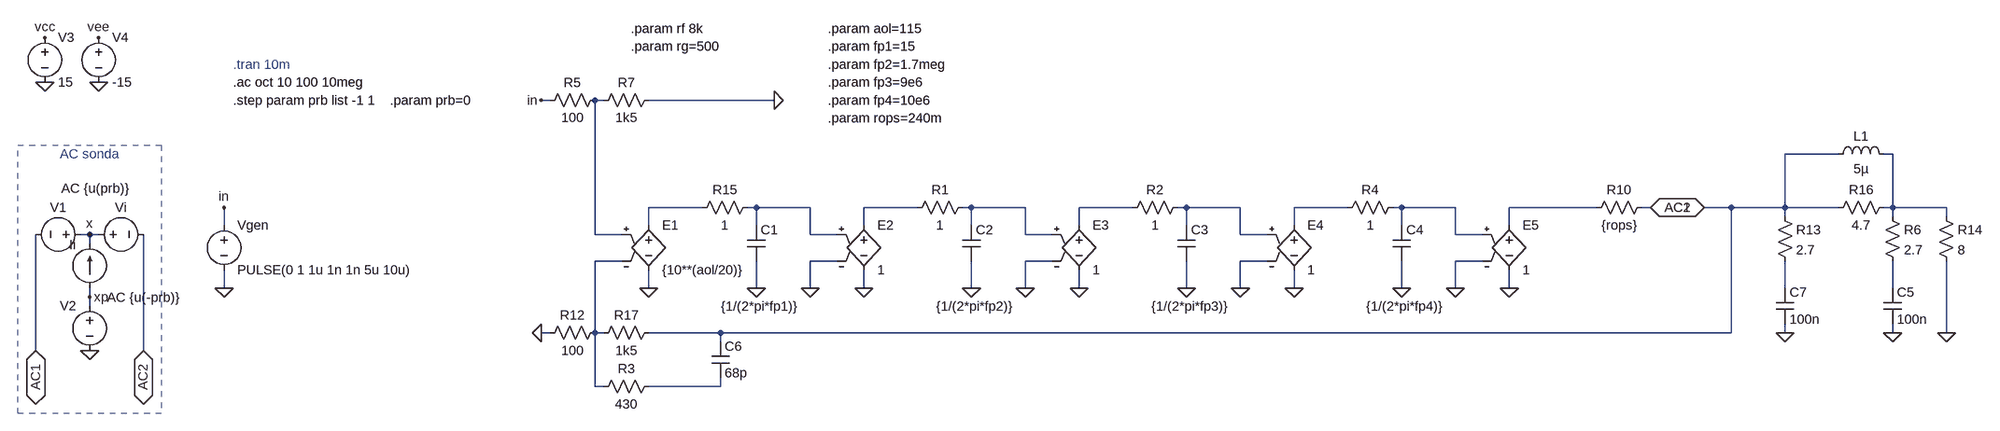
[diagram p0: schematic lm_ac.asc]
lm_ac.asc, the LTspice schematic file:
Version 4
SHEET 1 2596 680
WIRE -16 -96 -32 -96
WIRE 80 -96 64 -96
WIRE 384 -96 160 -96
WIRE 2336 0 2240 0
WIRE 2432 0 2416 0
WIRE 256 96 160 96
WIRE 352 96 336 96
WIRE 448 96 352 96
WIRE 640 96 544 96
WIRE 736 96 720 96
WIRE 832 96 736 96
WIRE 1024 96 928 96
WIRE 1120 96 1104 96
WIRE 1216 96 1120 96
WIRE 1408 96 1312 96
WIRE 1504 96 1488 96
WIRE 1600 96 1504 96
WIRE 1904 96 1696 96
WIRE 2000 96 1984 96
WIRE 2144 96 2096 96
WIRE 2240 96 2240 0
WIRE 2240 96 2144 96
WIRE 2336 96 2240 96
WIRE 2432 96 2432 0
WIRE 2432 96 2416 96
WIRE 2528 96 2432 96
WIRE 2240 112 2240 96
WIRE 2432 112 2432 96
WIRE 2528 112 2528 96
WIRE -608 128 -608 96
WIRE 160 128 160 96
WIRE 352 128 352 96
WIRE 544 128 544 96
WIRE 736 128 736 96
WIRE 928 128 928 96
WIRE 1120 128 1120 96
WIRE 1312 128 1312 96
WIRE 1504 128 1504 96
WIRE 1696 128 1696 96
WIRE -848 144 -864 144
WIRE -832 144 -848 144
WIRE 64 144 64 -96
WIRE 112 144 64 144
WIRE 448 144 448 96
WIRE 496 144 448 144
WIRE 832 144 832 96
WIRE 880 144 832 144
WIRE 1216 144 1216 96
WIRE 1264 144 1216 144
WIRE 1600 144 1600 96
WIRE 1648 144 1600 144
WIRE -848 160 -848 144
WIRE 112 192 64 192
WIRE 496 192 448 192
WIRE 880 192 832 192
WIRE 1264 192 1216 192
WIRE 1648 192 1600 192
WIRE -608 240 -608 208
WIRE 160 240 160 208
WIRE 352 240 352 192
WIRE 448 240 448 192
WIRE 544 240 544 208
WIRE 736 240 736 192
WIRE 832 240 832 192
WIRE 928 240 928 208
WIRE 1120 240 1120 192
WIRE 1216 240 1216 192
WIRE 1312 240 1312 208
WIRE 1504 240 1504 192
WIRE 1600 240 1600 192
WIRE 1696 240 1696 208
WIRE 2240 240 2240 192
WIRE 2432 240 2432 192
WIRE -848 256 -848 240
WIRE -848 272 -848 256
WIRE -16 320 -32 320
WIRE 64 320 64 192
WIRE 80 320 64 320
WIRE 288 320 160 320
WIRE 2144 320 2144 96
WIRE 2144 320 288 320
WIRE 2240 320 2240 304
WIRE 2432 320 2432 304
WIRE 2528 320 2528 192
WIRE 288 336 288 320
WIRE -944 352 -944 144
WIRE -752 352 -752 144
WIRE 64 416 64 320
WIRE 80 416 64 416
WIRE 288 416 288 400
WIRE 288 416 160 416
FLAG -608 240 0
FLAG 160 240 0
FLAG -608 96 in
FLAG -848 144 x
FLAG -848 256 xp
FLAG -944 352 AC1
IOPIN -944 352 BiDir
FLAG -752 352 AC2
IOPIN -752 352 BiDir
FLAG 2000 96 AC1
IOPIN 2000 96 BiDir
FLAG 2096 96 AC2
IOPIN 2096 96 BiDir
FLAG -848 352 0
FLAG 352 240 0
FLAG 544 240 0
FLAG 448 240 0
FLAG 736 240 0
FLAG 928 240 0
FLAG 832 240 0
FLAG 1120 240 0
FLAG 1312 240 0
FLAG 1216 240 0
FLAG 1504 240 0
FLAG 1696 240 0
FLAG 1600 240 0
FLAG 2240 320 0
FLAG 2432 320 0
FLAG 2528 320 0
FLAG -928 -128 0
FLAG -928 -208 vcc
FLAG -832 -128 0
FLAG -832 -208 vee
FLAG -32 320 0
FLAG -32 -96 in
FLAG 384 -96 0
SYMBOL voltage -608 112 R0
WINDOW 123 24 124 Left 2
WINDOW 39 0 0 Left 2
SYMATTR InstName Vgen
SYMATTR Value PULSE(0 1 1u 1n 1n 5u 10u)
SYMBOL e 160 112 R0
SYMATTR InstName E1
SYMATTR Value {10**(aol/20)}
SYMBOL current -848 240 R180
WINDOW 0 24 77 Left 2
WINDOW 3 24 0 Invisible 2
WINDOW 123 -71 178 Left 2
WINDOW 39 0 0 Left 2
SYMATTR InstName Ii
SYMATTR Value 0
SYMATTR Value2 AC {u(prb)}
SYMBOL voltage -848 144 R270
WINDOW 0 32 56 VTop 2
WINDOW 3 -32 56 Invisible 2
WINDOW 123 -97 96 VBottom 2
WINDOW 39 -32 56 VBottom 2
SYMATTR InstName Vi
SYMATTR Value 0
SYMATTR Value2 AC {u(-prb)}
SYMBOL voltage -848 144 R90
WINDOW 0 -32 56 VBottom 2
WINDOW 3 32 56 Invisible 2
WINDOW 123 0 0 Left 2
WINDOW 39 0 0 Left 2
SYMATTR InstName V1
SYMATTR Value 0
SYMBOL voltage -848 256 M0
WINDOW 123 0 0 Left 2
WINDOW 39 0 0 Left 2
WINDOW 3 24 96 Invisible 2
SYMATTR Value 0
SYMATTR InstName V2
SYMBOL res 2000 80 R90
WINDOW 0 0 56 VBottom 2
WINDOW 3 32 56 VTop 2
SYMATTR InstName R10
SYMATTR Value {rops}
SYMBOL res 352 80 R90
WINDOW 0 0 56 VBottom 2
WINDOW 3 32 56 VTop 2
SYMATTR InstName R15
SYMATTR Value 1
SYMBOL cap 336 128 R0
WINDOW 3 -47 145 Left 2
SYMATTR Value {1/(2*pi*fp1)}
SYMATTR InstName C1
SYMBOL e 544 112 R0
SYMATTR InstName E2
SYMATTR Value 1
SYMBOL res 736 80 R90
WINDOW 0 0 56 VBottom 2
WINDOW 3 32 56 VTop 2
SYMATTR InstName R1
SYMATTR Value 1
SYMBOL cap 720 128 R0
WINDOW 3 -47 145 Left 2
SYMATTR Value {1/(2*pi*fp2)}
SYMATTR InstName C2
SYMBOL e 928 112 R0
SYMATTR InstName E3
SYMATTR Value 1
SYMBOL res 1120 80 R90
WINDOW 0 0 56 VBottom 2
WINDOW 3 32 56 VTop 2
SYMATTR InstName R2
SYMATTR Value 1
SYMBOL cap 1104 128 R0
WINDOW 3 -47 145 Left 2
SYMATTR Value {1/(2*pi*fp3)}
SYMATTR InstName C3
SYMBOL e 1312 112 R0
SYMATTR InstName E4
SYMATTR Value 1
SYMBOL res 1504 80 R90
WINDOW 0 0 56 VBottom 2
WINDOW 3 32 56 VTop 2
SYMATTR InstName R4
SYMATTR Value 1
SYMBOL cap 1488 128 R0
WINDOW 3 -47 145 Left 2
SYMATTR Value {1/(2*pi*fp4)}
SYMATTR InstName C4
SYMBOL e 1696 112 R0
SYMATTR InstName E5
SYMATTR Value 1
SYMBOL res 2224 96 R0
SYMATTR InstName R13
SYMATTR Value 2.7
SYMBOL cap 2224 240 R0
SYMATTR InstName C7
SYMATTR Value 100n
SYMBOL res 2512 96 R0
SYMATTR InstName R14
SYMATTR Value 8
SYMBOL res 2432 80 R90
WINDOW 0 0 56 VBottom 2
WINDOW 3 32 56 VTop 2
SYMATTR InstName R16
SYMATTR Value 4.7
SYMBOL ind 2320 16 R270
WINDOW 0 32 56 VTop 2
WINDOW 3 5 56 VBottom 2
SYMATTR InstName L1
SYMATTR Value 5µ
SYMBOL res 2416 96 R0
SYMATTR InstName R6
SYMATTR Value 2.7
SYMBOL cap 2416 240 R0
SYMATTR InstName C5
SYMATTR Value 100n
SYMBOL voltage -928 -224 R0
WINDOW 123 0 0 Left 2
WINDOW 39 0 0 Left 2
SYMATTR InstName V3
SYMATTR Value 15
SYMBOL voltage -832 -224 R0
WINDOW 123 0 0 Left 2
WINDOW 39 0 0 Left 2
SYMATTR InstName V4
SYMATTR Value -15
SYMBOL res 80 304 R90
WINDOW 0 0 56 VBottom 2
WINDOW 3 32 56 VTop 2
SYMATTR InstName R12
SYMATTR Value 100
SYMBOL res 176 304 R90
WINDOW 0 0 56 VBottom 2
WINDOW 3 32 56 VTop 2
SYMATTR InstName R17
SYMATTR Value 1k5
SYMBOL cap 272 336 R0
SYMATTR InstName C6
SYMATTR Value 68p
SYMBOL res 176 400 R90
WINDOW 0 0 56 VBottom 2
WINDOW 3 32 56 VTop 2
SYMATTR InstName R3
SYMATTR Value 430
SYMBOL res 80 -112 R90
WINDOW 0 0 56 VBottom 2
WINDOW 3 32 56 VTop 2
SYMATTR InstName R5
SYMATTR Value 100
SYMBOL res 176 -112 R90
WINDOW 0 0 56 VBottom 2
WINDOW 3 32 56 VTop 2
SYMATTR InstName R7
SYMATTR Value 1k5
TEXT -592 -160 Left 2 ;.tran 10m
TEXT -592 -128 Left 2 !.ac oct 10 100 10meg
TEXT -848 0 Center 2 ;AC sonda
TEXT -592 -96 Left 2 !.step param prb list -1 1
TEXT 480 -224 Left 2 !.param aol=115
TEXT 480 -192 Left 2 !.param fp1=15
TEXT 480 -160 Left 2 !.param fp2=1.7meg
TEXT 480 -128 Left 2 !.param fp3=9e6
TEXT 480 -96 Left 2 !.param fp4=10e6
TEXT 128 -224 Left 2 !.param rf 8k
TEXT 128 -192 Left 2 !.param rg=500
TEXT -312 -96 Left 2 !.param prb=0
TEXT 480 -64 Left 2 !.param rops=240m
RECTANGLE Normal -720 464 -976 -16 2

The netlist it stands for:
* lm_ac.asc
Vgen in 0 PULSE(0 1 1u 1n 1n 5u 10u)
E1 N003 0 N001 N012 {10**(aol/20)}
Ii xp x 0 AC {u(prb)}
Vi x AC2 0 AC {u(-prb)}
V1 x AC1 0
V2 xp 0 0
R10 AC1 N011 {rops}
R15 N004 N003 1
C1 N004 0 {1/(2*pi*fp1)}
E2 N005 0 N004 0 1
R1 N006 N005 1
C2 N006 0 {1/(2*pi*fp2)}
E3 N007 0 N006 0 1
R2 N008 N007 1
C3 N008 0 {1/(2*pi*fp3)}
E4 N009 0 N008 0 1
R4 N010 N009 1
C4 N010 0 {1/(2*pi*fp4)}
E5 N011 0 N010 0 1
R13 AC2 N013 2.7
C7 N013 0 100n
R14 N002 0 8
R16 N002 AC2 4.7
L1 AC2 N002 5µ
R6 N002 N014 2.7
C5 N014 0 100n
V3 vcc 0 15
V4 vee 0 -15
R12 N012 0 100
R17 AC2 N012 1k5
C6 AC2 N015 68p
R3 N015 N012 430
R5 N001 in 100
R7 0 N001 1k5
* .tran 10m
.ac oct 10 100 10meg
* AC sonda
.step param prb list -1 1
.param aol=115
.param fp1=15
.param fp2=1.7meg
.param fp3=9e6
.param fp4=10e6
.param rf 8k
.param rg=500
.param prb=0
.param rops=240m
.backanno
.end